# Altium schematic sheet Sheet2.SchDoc
size A4; SheetNumber: 2; SheetTotal: 2
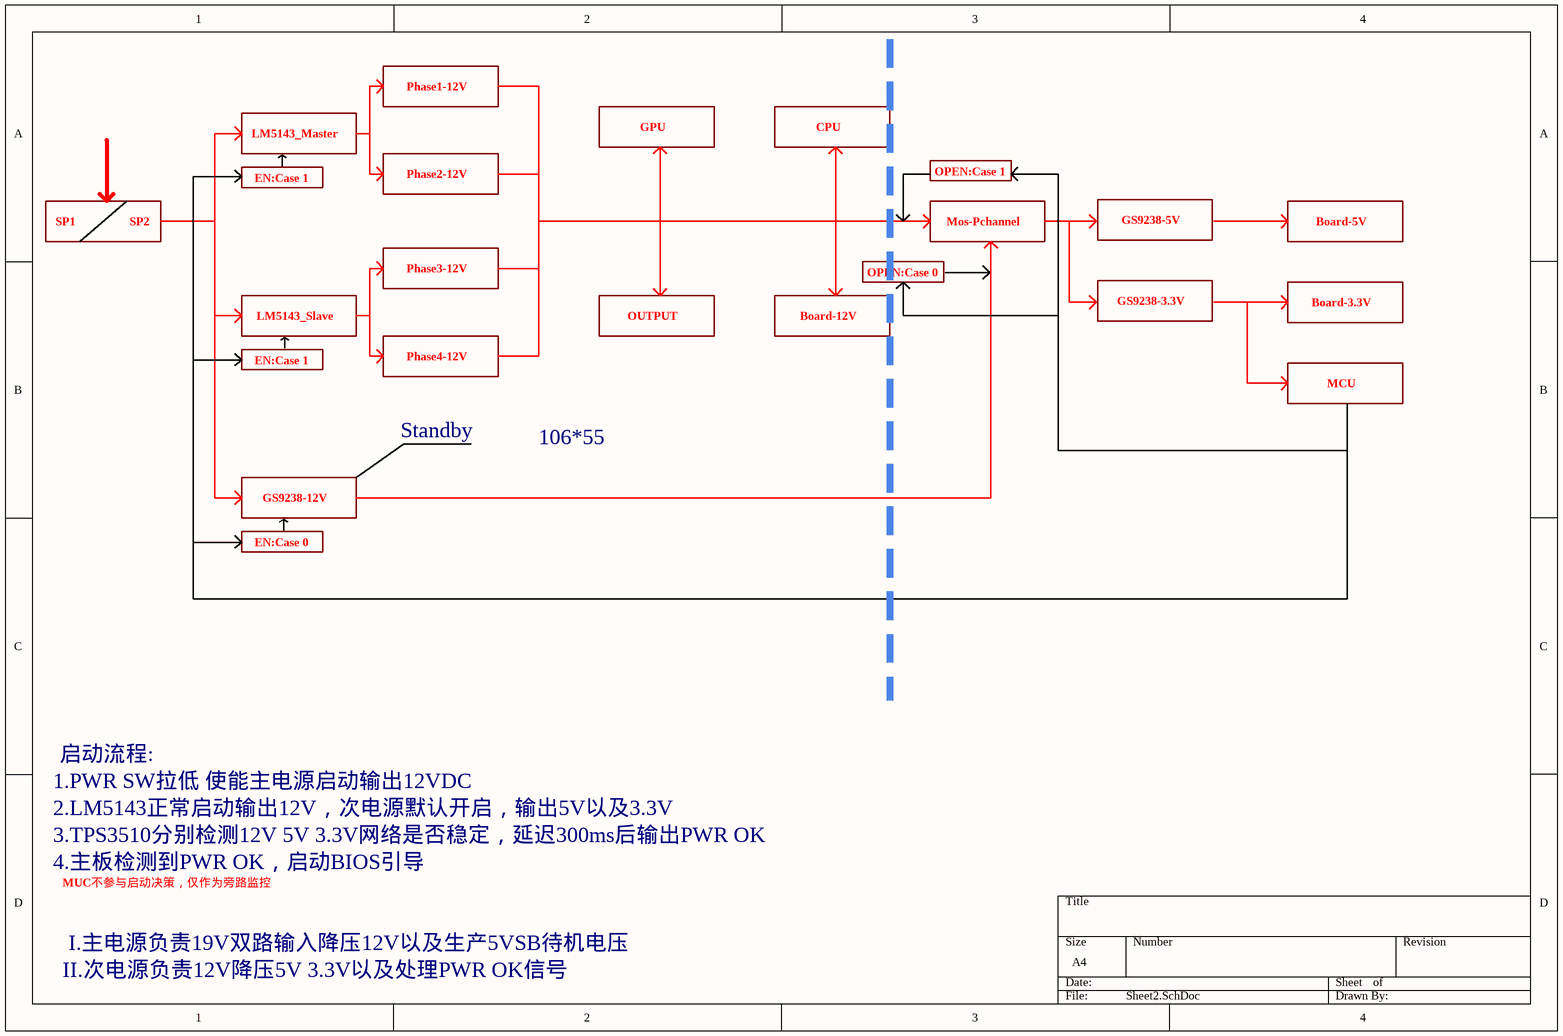
[diagram p0: Sheet2.SchDoc]

## Notes on the sheet
- Phase1-12V
- EN:Case 1
- LM5143_Master
- Phase2-12V
- GPU
- CPU
- OPEN:Case 1
- SP1
- SP2
- Mos-Pchannel
- GS9238-5V
- Board-5V
- LM5143_Slave
- Phase3-12V
- OUTPUT
- Board-12V
- OPEN:Case 0
- GS9238-3.3V
- Board-3.3V
- Phase4-12V
- MCU
- Standby
- 106*55
- GS9238-12V
- EN:Case 0
- 1.PWR SW拉低 使能主电源启动输出12VDC
- 启动流程:
- 2.LM5143正常启动输出12V，次电源默认开启，输出5V以及3.3V
- 3.TPS3510分别检测12V 5V 3.3V网络是否稳定，延迟300ms后输出PWR OK
- 4.主板检测到PWR OK，启动BIOS引导
- MUC不参与启动决策，仅作为旁路监控
- II.次电源负责12V降压5V 3.3V以及处理PWR OK信号
- I.主电源负责19V双路输入降压12V以及生产5VSB待机电压